# Altium schematic sheet Supply.SchDoc
size A4; SheetNumber: 2; SheetTotal: 12; Time: Supply
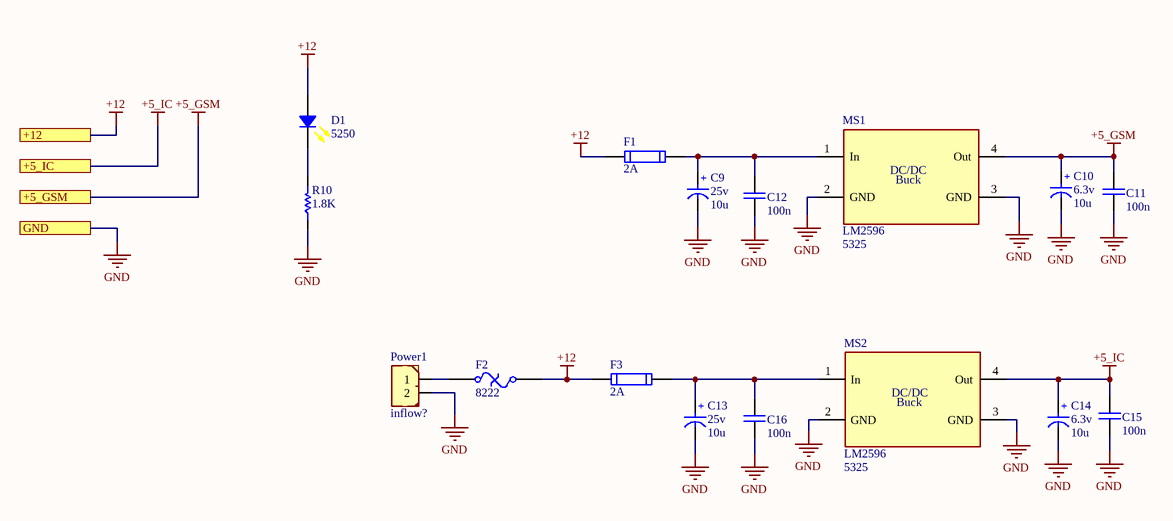
[diagram p0: Supply.SchDoc]

## Parts
C9  Rating: 25v  [SMT_C_Tantalum_B]  (hidden comment: 10u)
C10  Rating: 6.3v  [SMT_C_Tantalum_B]  (hidden comment: 10u)
C11  100n  [CAP 1206/3216]
C12  100n  [CAP 1206/3216]
C13  Rating: 25v  [SMT_C_Tantalum_B]  (hidden comment: 10u)
C14  Rating: 6.3v  [SMT_C_Tantalum_B]  (hidden comment: 10u)
C15  100n  [CAP 1206/3216]
C16  100n  [CAP 1206/3216]
D1  Inflow: 5250  [LED 1206/3216 YELLOW]  (hidden comment: Yellow, 1206)
F1  2A  [1206_F]
F2  Inflow: 8222  [PIN-W2/E2.8]  (hidden comment: 180'C, 10'A)
F3  2A  [1206_F]
MS1  Inflow: 5325  [LM2596_modsen]  (hidden comment: LM2596)
MS2  Inflow: 5325  [LM2596_modsen]  (hidden comment: LM2596)
Power1  Inflow: inflow?  [Phoenix_2PIN_RA_P5.08mm]  (hidden comment: 2'Pin)
R10  1.8K  [RES 1206 (3216X08L)]

## Ports
+5_GSM, +5_IC, +12, GND

## Nets
+5_GSM: C10.1(+) C11.1 MS1.4(Out) ; port +5_GSM
+5_IC: C14.1(+) C15.1 MS2.4(Out) ; port +5_IC
+12: D1.1 F1.1 F2.2 F3.1 ; port +12
GND: C9.2(-) C10.2(-) C11.2 C12.2 C13.2(-) C14.2(-) C15.2 C16.2 MS1.2(GND) MS1.3(GND) MS2.2(GND) MS2.3(GND) Power1.2 R10.1 ; port GND
NetC9_1: C9.1(+) C12.1 F1.2 MS1.1(In)
NetC13_1: C13.1(+) C16.1 F3.2 MS2.1(In)
NetD1_2: D1.2 R10.2
NetF2_1: F2.1 Power1.1

## Notes on the sheet
- Title:
- Project:
- Drawn by:
- Revision:
- Hossein Bagheri
- Company:
- Sheet
- of
- (in symbol ModSen_LM2596) DC/DC; Buck

## Library data of the parts
C9 C10 C13 C14 = Cap_Tantalum: Tantalum Capacitor,TAJ Series-SMD; Inflow: inflow?; Validation: Valid; Package: Package?; Type: Tantalum; Value: 10u
C11 C12 C15 C16 = Cap_Multi_SMD_100nF_1206: Bipolar ceramic capacitor SMD; Type: MultiLayer; Inflow: inflow?; Rating: 50V; Validation: Valid; Package: 1206; Value: 100n
D1 = Semi_LED_Yellow_1206: LED; Rating: Rating?; Type: Type?; Validation: Valid; Value: Yellow, 1206; Package: Package?
F1 F3 = Other_Elec_Fuse_SMD: Short circiut  protection; Inflow: inflow?; Type: Fast; Rating: Rating?; Validation: Valid; Package: 1206; Value: 2A
F2 = Other_Elec_Fuse_Thermal: Thermal Fuse; Rating: Rating?; Type: Type?; Validation: NT; Value: 180'C, 10'A; Package: Package?
MS1 MS2 = ModSen_LM2596: DC to DC Buck converter 1.23V-30V 3A; Rating: Rating?; Validation: Valid; Package: Package?; Type: Type?; Value: LM2596
Power1 = Con_Power_2: Power Connector 2'Pin; Rating: Rating?; Validation: NT; Value: 2'Pin; Package: Package?; Type: Type?
R10 = Res_SMD_1206: Resistor; Inflow: inflow?; Rating: 0.25W; Validation: Valid; Package: 1206; Type: 10%; Value: 1.8K